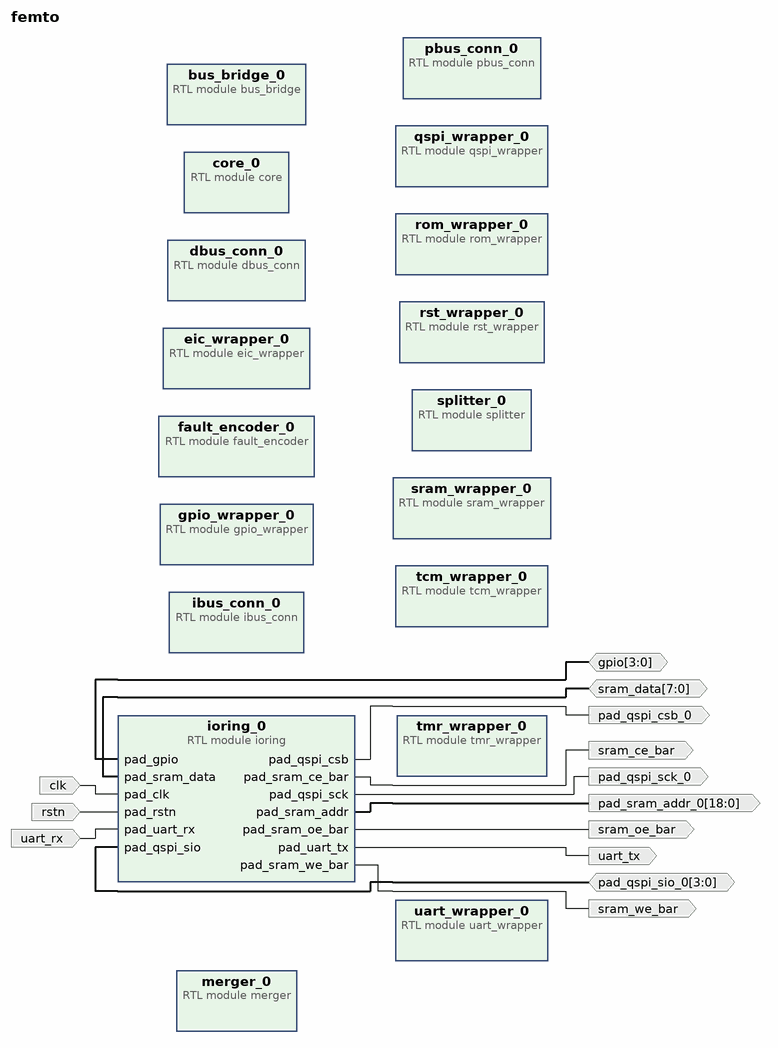
[diagram p0: block diagram of the top level]
# Vivado block design femto, xc7a35tcpg236-1, Vivado 2018.2
create_bd_design femto

create_bd_port -dir I clk
create_bd_port -dir I rstn
create_bd_port -dir I uart_rx
create_bd_port -dir IO -from 3 -to 0 gpio
create_bd_port -dir O uart_tx
create_bd_port -dir O sram_ce_bar
create_bd_port -dir O sram_oe_bar
create_bd_port -dir O sram_we_bar
create_bd_port -dir IO -from 7 -to 0 sram_data
create_bd_port -dir O -from 18 -to 0 pad_sram_addr_0
create_bd_port -dir O pad_qspi_sck_0
create_bd_port -dir O pad_qspi_csb_0
create_bd_port -dir IO -from 3 -to 0 pad_qspi_sio_0

create_bd_cell -type module -reference merger merger_0
create_bd_cell -type module -reference splitter splitter_0
create_bd_cell -type module -reference qspi_wrapper qspi_wrapper_0
create_bd_cell -type module -reference core core_0
create_bd_cell -type module -reference ioring ioring_0
create_bd_cell -type module -reference rom_wrapper rom_wrapper_0
create_bd_cell -type module -reference sram_wrapper sram_wrapper_0
create_bd_cell -type module -reference eic_wrapper eic_wrapper_0
create_bd_cell -type module -reference tcm_wrapper tcm_wrapper_0
create_bd_cell -type module -reference fault_encoder fault_encoder_0
create_bd_cell -type module -reference rst_wrapper rst_wrapper_0
create_bd_cell -type module -reference gpio_wrapper gpio_wrapper_0
create_bd_cell -type module -reference tmr_wrapper tmr_wrapper_0
create_bd_cell -type module -reference uart_wrapper uart_wrapper_0
create_bd_cell -type module -reference bus_bridge bus_bridge_0
create_bd_cell -type module -reference dbus_conn dbus_conn_0
create_bd_cell -type module -reference ibus_conn ibus_conn_0
create_bd_cell -type module -reference pbus_conn pbus_conn_0

# ---- connections ----

connect_bd_net -net pad_clk_0_1 [get_bd_ports clk] [get_bd_pins ioring_0/pad_clk]
connect_bd_net -net pad_rstn_0_1 [get_bd_ports rstn] [get_bd_pins ioring_0/pad_rstn]
connect_bd_net -net pad_uart_rx_0_1 [get_bd_ports uart_rx] [get_bd_pins ioring_0/pad_uart_rx]
connect_bd_net [get_bd_ports gpio] [get_bd_pins ioring_0/pad_gpio]
connect_bd_net [get_bd_pins ioring_0/pad_uart_tx] [get_bd_ports uart_tx]
connect_bd_net [get_bd_pins ioring_0/pad_sram_ce_bar] [get_bd_ports sram_ce_bar]
connect_bd_net [get_bd_pins ioring_0/pad_sram_oe_bar] [get_bd_ports sram_oe_bar]
connect_bd_net [get_bd_pins ioring_0/pad_sram_we_bar] [get_bd_ports sram_we_bar]
connect_bd_net [get_bd_ports sram_data] [get_bd_pins ioring_0/pad_sram_data]
connect_bd_net [get_bd_pins ioring_0/pad_sram_addr] [get_bd_ports pad_sram_addr_0]
connect_bd_net [get_bd_pins ioring_0/pad_qspi_sck] [get_bd_ports pad_qspi_sck_0]
connect_bd_net [get_bd_pins ioring_0/pad_qspi_csb] [get_bd_ports pad_qspi_csb_0]
connect_bd_net [get_bd_ports pad_qspi_sio_0] [get_bd_pins ioring_0/pad_qspi_sio]

validate_bd_design
save_bd_design
